# Altium schematic sheet REGENIX_Battery_Protection.SchDoc
size Tabloid; Date: Date; Author: Author 1; Revision: 1; SheetNumber: 2; SheetTotal: 2; Size: 11x17; Sheet_Name: BATTERY PROTECTION & AUXILIARY
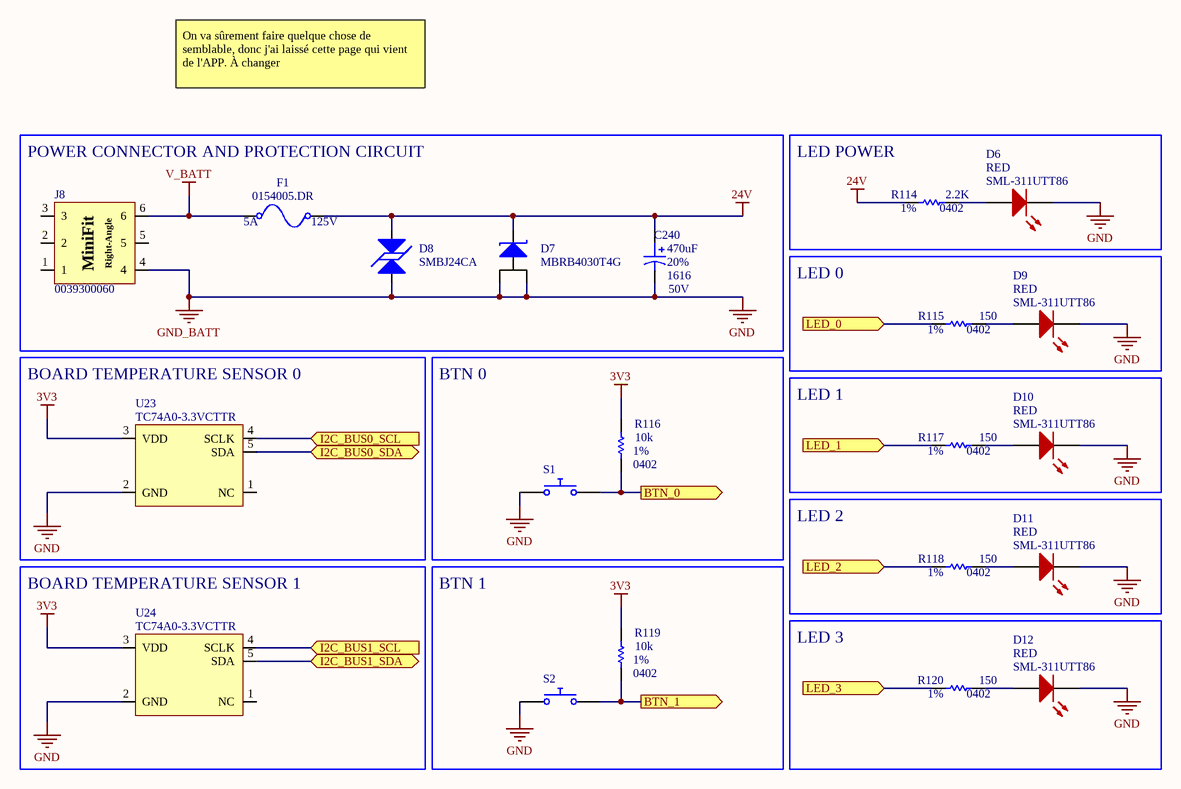
[diagram p0: REGENIX_Battery_Protection.SchDoc]

## Parts
C240  value 470uF  Voltage: 50V  Package: 1616  Precision: 20%  [CAP_ALU_1616_vishay]  (hidden comment: MAL214699108E3)
D6  SML-311UTT86  value RED  [LED_0603]
D7  MBRB4030T4G  [DIO_SCHOTTKY_MBRB4030T4G]
D8  SMBJ24CA  [TVS_PWR_SMBJ36CA]
D9  SML-311UTT86  value RED  [LED_0603]
D10  SML-311UTT86  value RED  [LED_0603]
D11  SML-311UTT86  value RED  [LED_0603]
D12  SML-311UTT86  value RED  [LED_0603]
F1  0154005.DR  Voltage Rating: 125V  Current Rating: 5A  [FUS_0154XXX.DR]
J8  0039300060  [CON_MINIFIT_0039300060]
R114  value 2.2K  Package: 0402  Precision: 1%  [RES_0402]  (hidden comment: RES - 0402)
R115  value 150  Package: 0402  Precision: 1%  [RES_0402]  (hidden comment: RES - 0402)
R116  value 10k  Package: 0402  Precision: 1%  [RES_0402]  (hidden comment: RES - 0402)
R117  value 150  Package: 0402  Precision: 1%  [RES_0402]  (hidden comment: RES - 0402)
R118  value 150  Package: 0402  Precision: 1%  [RES_0402]  (hidden comment: RES - 0402)
R119  value 10k  Package: 0402  Precision: 1%  [RES_0402]  (hidden comment: RES - 0402)
R120  value 150  Package: 0402  Precision: 1%  [RES_0402]  (hidden comment: RES - 0402)
S1  Push Button Normally Opened  (value not drawn)
S2  Push Button Normally Opened  (value not drawn)
U23  TC74A0-3.3VCTTR  [SEN_TEMP_TC74A0-3.3VCTTR]
U24  TC74A0-3.3VCTTR  [SEN_TEMP_TC74A0-3.3VCTTR]

## Blocks framed on the sheet
POWER CONNECTOR AND PROTECTION CIRCUIT: C240 D7 D8 F1 J8
LED POWER: D6 R114
LED 0: D9 R115
BOARD TEMPERATURE SENSOR 0: U23
BTN 0: R116 S1
LED 1: D10 R117
LED 2: D11 R118
BOARD TEMPERATURE SENSOR 1: U24
BTN 1: R119 S2
LED 3: D12 R120

## Ports
BTN_0 (out), BTN_1 (out), I2C_BUS0_SCL (in), I2C_BUS0_SDA (bidir), I2C_BUS1_SCL (in), I2C_BUS1_SDA (bidir), LED_0 (in), LED_1 (in), LED_2 (in), LED_3 (in)

## Nets
3V3: R116.2 R119.2 U23.3(VDD) U24.3(VDD)
24V: C240.1 D7.4 D8.1 F1.2 R114.2
GND: C240.2 D6.K D7.1(A) D7.3 D8.2 D9.K D10.K D11.K D12.K J8.4 S1.1 S2.1 U23.2(GND) U24.2(GND)  [also labelled GND_BATT]
V_BATT: F1.1 J8.6
BTN_0: R116.1 S1.2 ; port BTN_0
BTN_1: R119.1 S2.2 ; port BTN_1
I2C_BUS0_SCL: U23.4(SCLK) ; port I2C_BUS0_SCL
I2C_BUS0_SDA: U23.5(SDA) ; port I2C_BUS0_SDA
I2C_BUS1_SCL: U24.4(SCLK) ; port I2C_BUS1_SCL
I2C_BUS1_SDA: U24.5(SDA) ; port I2C_BUS1_SDA
LED_0: R115.2 ; port LED_0
LED_1: R117.2 ; port LED_1
LED_2: R118.2 ; port LED_2
LED_3: R120.2 ; port LED_3
NetD6_A: D6.A R114.1
NetD9_A: D9.A R115.1
NetD10_A: D10.A R117.1
NetD11_A: D11.A R118.1
NetD12_A: D12.A R120.1

Not connected (* = marked no-connect by the designer): J8 1 2 3 5; U23 1(NC); U24 1(NC)

## Notes on the sheet
- On va sûrement faire quelque chose de semblable, donc j'ai laissé cette page qui vient de l'APP. À changer
- Sheet Name
- Project Title
- Global Project
- Revision
- Size
- Date
- Group
- Sheet
- of
- Filename
- Designers
- (in symbol CON_MINIFIT_0039300060) MiniFit; Right-Angle

## Library data of the parts
C240 = CAP_ALU_MAL214699108E3: CAP - ALU 470uF 20% 50V - 1616; Current: 1.3A; Mfg: Vishay Dale; Mfg Part Number: MAL214699108E3; HelpURL: http://www.vishay.com/docs/28403/146cti.pdf; CreatedBy: Jonathan Bouchard; Temperature: -55°C to 125°C; Power: *; Supplier 1: Digikey; Supplier Part Number 1: 4442PHCT-ND
D6 D9-D12 = LED_SML-311UTT86: LED - 620nM RED 2mA - 0603; Voltage: 1.8V; Mfg: ROHM Semiconductor; Power: 44mW; Current: 2mA; HelpURL: http://media.digikey.com/pdf/Data%20Sheets/Rohm%20PDFs/SML-311%20Series.pdf; CreatedBy: Jonathan Bouchard; Temperature: -30°C to 85°C; Package: 0603; Precision: *; Mfg Part Number: SML-311UTT86; Supplier 1: Digikey; Supplier Part Number 1: 511-1304-1-ND
D7 = DIO_SCHOTTKY_MBRB4030T4G: DIO - 30V MAX 40 A - TO-263-3; Manufacturer #1: ON Semiconductor; Value: Vf = 550mV @ 40A; Current Rating: 40A; GRAMS Lib Spec: 2.8; Magnetic Material: NO; Polarized: Yes; Cryo: UNKNOWN; Tolerance: *; Voltage Rating: 30V; Power Max: *; HelpURL: http://www.onsemi.com/pub/Collateral/MBRB4030-D.PDF; CreatedBy/Date: Arnaud Samson - 06/07/18; VerifiedBy: Jonathan Bouchard 2018-07-12; Temperature: -65°C ~ 175°C; Package: D2PAK; Manufacturer #2: *; Note: *; Assembly Type: SMD; Part Number #2: *; Part Number #1: MBRB4030T4G; Supplier 1: Digi-Key; Supplier Part Number 1: MBRB4030T4GOSCT-ND
D8 = TVS_PWR_SMBJ24CA: TVS - 24V 26.7V 600W - DO214AA; Manufacturer #1: Littelfuse Inc.; Value: Vbr = 26.7V -  Clamp = 38.9V; Voltage Rating: 24V Standoff; Current Rating: 15.5A; GRAMS Lib Spec: 2.8; Magnetic Material: UNKNOWN; Polarized: NO; Tolerance: *; Power Max: 600W; HelpURL: http://www.littelfuse.com/~/media/electronics/datasheets/tvs_diodes/littelfuse_tvs_diode_smbj_datasheet.pdf.pdf; CreatedBy/Date: Arnaud Samson - 06/07/18; VerifiedBy: Jonathan Bouchard - 2018-07-13; Temperature: -65°C ~ 150°C (TJ); Package: DO214AA; Manufacturer #2: *; Note: *; Assembly Type: SMD; Part Number #2: *; Part Number #1: SMBJ24CA; Supplier 1: Digi-Key; Supplier Part Number 1: SMBJ24CALFCT-ND; Cryo: UNKNOWN
F1 = FUS_0154005.DR: FUS - 5 A 125 VAC/VDC - 2-SMD; Manufacturer #1: Littelfuse Inc.; Value: 5A 125V AC/DC FAST; GRAMS Lib Spec: 2.8; Magnetic Material: UNKNOWN; Polarized: NO; Tolerance: *; Power Max: *; HelpURL: http://www.littelfuse.com/~/media/electronics/datasheets/fuses/littelfuse_fuse_154_154t_154l_154tl_datasheet.pdf.pdf; CreatedBy/Date: Arnaud Samson - 06/07/18; VerifiedBy: Jonathan Bouchard 2018-07-16; Temperature: -55°C ~ 125°C; Package: 2-SMD; Manufacturer #2: *; Note: *; Assembly Type: SMD; Part Number #2: *; Part Number #1: 0154005.DR; Supplier 1: Digi-Key; Supplier Part Number 1: F1228CT-ND; Cryo: UNKNOWN
J8 = CON_MINIFIT_0039300060: CON - Mini-Fit Through Hole, Right Angle 6 position; Manufacturer #1: Molex; Current Rating: 8A; GRAMS Lib Spec: 2.8; Magnetic Material: Unknown; Polarized: Yes; Voltage Rating: 600V; Assembly Type: TH; CreatedBy/Date: Joel Lemay 2018-06-21; HelpURL: https://www.molex.com/pdm_docs/sd/039300060_sd.pdf; Manufacturer #2: *; Package: TH; Part Number #1: 0039300060; Part Number #2: *; Power Max: *; Supplier 1: Digi-Key; Supplier Part Number 1: WM21353-ND; Temperature: - 40°C to + 80°C; Tolerance: *; Value: *; VerifiedBy: Caroline Paulin - 10 sept 2018; Cryo: UNKNOWN
R114-R120 = RES - 0402: Voltage: 50V; Power: 1/16W; Current: *; CreatedBy: Jonathan Bouchard
S1 S2 = Push Button NO: closed: 0; Rclosed: 1m; Ropen: 1Meg; SimulationGenericComponent: True
U23 U24 = SENS_TEMP_TC74A0-3.3VCTTR: SENS - TEMPERATURE SENSOR I2C/SMBUS - SOT23-5; Voltage: 2.7 V ~ 5.5 V; Mfg: Microchip; Precision: ±2°C (±3°C); Current: *; Power: *; Mfg Part Number: TC74A0-3.3VCTTR; HelpURL: http://ww1.microchip.com/downloads/en/DeviceDoc/21462D.pdf; CreatedBy: Jonathan Bouchard; Temperature: -40°C ~ 125°C; Value: *; Package: SOT23-5; Supplier 1: Digikey; Supplier Part Number 1: TC74A0-3.3VCTDKR-ND